# EasyEDA schematic SCH_Aquaguard-system_2026-05-28.json
TITLE: Aquaguard project; REV: 1.0; Date: 2025-04-28; Sheet: 1/1; Drawn By: Mostapha Droubi; Company: Your Company
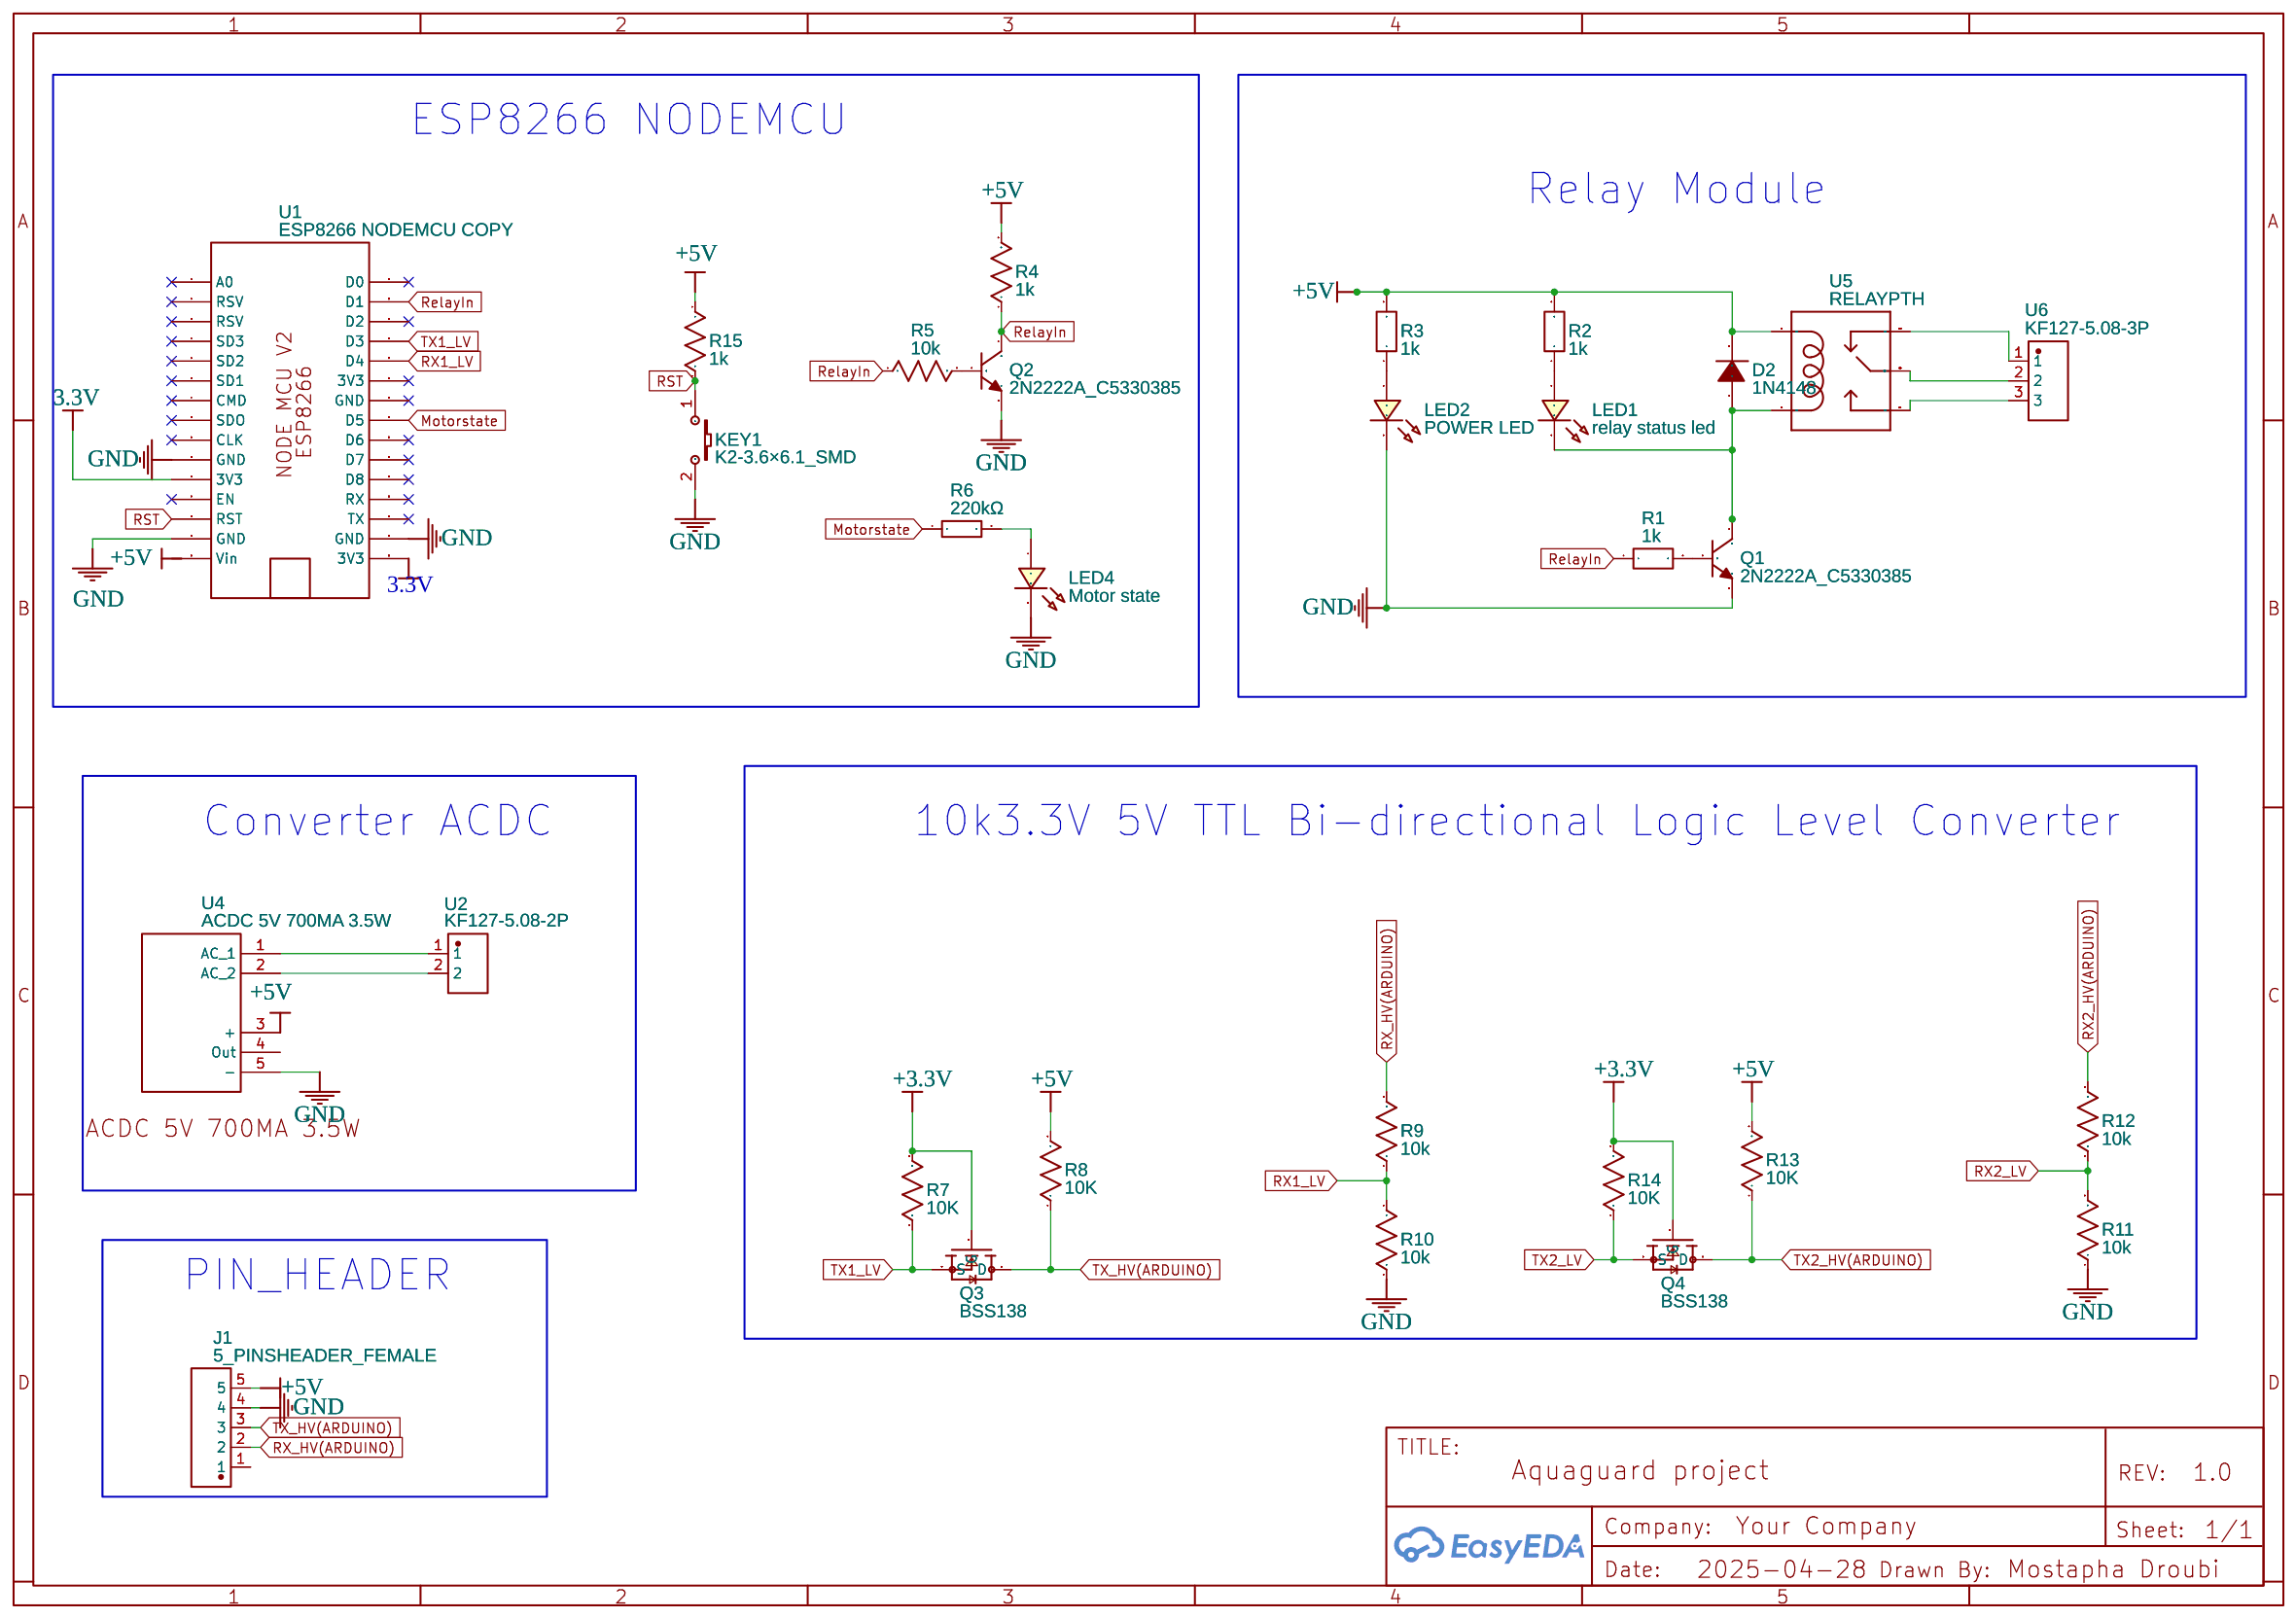
[diagram p0: schematic sheet]

## Parts
D2  1N4148  [DO-35_BD2.0-L4.0-P8.00-D0.5-FD]
J1  5_PINSHEADER_FEMALE  [6_PINSHEADER_FEMALE]
KEY1  K2-3.6×6.1_SMD  [KEY-SMD_2P-L6.2-W3.6-LS8.0]
LED1  relay status led  [LED-TH_BD3.0_GREEN]
LED2  POWER LED  [LED0603_RED]
LED4  Motor state  [LED0805_BLUE]
Q1  2N2222A_C5330385  [TO-92-3_L4.8-W3.7-P2.54-R]
Q2  2N2222A_C5330385  [TO-92-3_L4.8-W3.7-P2.54-R]
Q3  BSS138  [BSS138]
Q4  BSS138  [BSS138]
R1  1k  [R0201]
R2  1k  [R0201]
R3  1k  [R0201]
R4  1k  [R0603]
R5  10k  [R0603]
R6  220kΩ  [R0805]
R7  10K  [R0603]
R8  10K  [R0603]
R9  10k  [R0603]
R10  10k  [R0603]
R11  10k  [R0603]
R12  10k  [R0603]
R13  10K  [R0603]
R14  10K  [R0603]
R15  1k  [R0603]
U1  ESP8266 NODEMCU COPY  [ESP8266NODEMCU]
U2  KF127-5.08-2P  [CONN-TH_P5.08_KF127-5.08-2P]
U4  ACDC 5V 700MA 3.5W  [ACDC 5V 700MA 3.5W]
U5  RELAYPTH  [SRD-05VDC-SL-C]
U6  KF127-5.08-3P  [CONN-TH_3P-P5.08_KF127-5.08-3P]

## Library data of the parts
D2 = 1N4148: Supplier: LCSC; Manufacturer: ST(先科); Supplier Part: C14516; JLCPCB Part Class: Extended Part
J1 = 5_PINSHEADER_FEMALE: catid: 20; Contributor: kronto; sim: true
KEY1 = K2-3.6×6.1_SMD: Supplier Part: C118141; Supplier: LCSC; Manufacturer Part: K2-1107ST-A4SW-06; Contributor: LCEDA_Lib; 制造商: 韩国韩荣
LED1 = LED-TH-3mm_G: Manufacturer: EVERLIGHT(台湾亿光); Manufacturer Part: 204-10SYGD/S530-E3; Supplier Part: C85161; Contributor: LCEDA_Lib
LED2 = LED-0603_R: Manufacturer: EVERLIGHT(台湾亿光); Manufacturer Part: 19-217/R6C-AL1M2VY/3T; Supplier Part: C72044; Supplier: LCSC; Contributor: LCEDA_01
LED4 = LED-0805_B: Manufacturer: 方舟 ARKLED; Manufacturer Part: D-B080508B1-KS2; Supplier Part: C108412; Contributor: LCEDA_Lib
Q1 Q2 = 2N2222A_C5330385: Contributor: lcsc; Supplier: LCSC; Supplier Part: C5330385; Manufacturer: Slkor(萨科微); Manufacturer Part: 2N2222A; JLCPCB Part Class: Extended Part
Q3 Q4 = BSS138: Contributor: The_Doogy; Supplier: RS-Online; Supplier Part: 671-0324; Manufacturer: ON Semiconductor; link: https://www.onsemi.com/products/discretes-drivers/mosfets/bss138
R1-R3 = R_0201_EU: Contributor: LCEDA_Lib
R4 R5 R7-R15 = R_0603_US: Contributor: LCEDA_Lib
R6 = RC0805JR-07220KL: Contributor: LCSC; Supplier: LCSC; Manufacturer: YAGEO(国巨); Supplier Part: C114232; JLCPCB Part Class: Extended Part
U1 = ESP8266 NODEMCU COPY: Contributor: projakjo
U2 = KF127-5.08-2P: Contributor: LCSC; Supplier: LCSC; Supplier Part: C474906; Manufacturer: KEFA(科发); JLCPCB Part Class: Extended Part
U4 = ACDC 5V 700MA 3.5W: Contributor: valinotech
U5 = RELAYPTH: SPDT relay (COM-00101)
U6 = KF127-5.08-3P: Contributor: LCSC; Supplier: LCSC; Supplier Part: C474907; Manufacturer: KEFA(科发); JLCPCB Part Class: Extended Part

## Nets
3.3V: U1.11(3V3) U1.16(3V3)
+3.3V: Q3.G Q4.G R7.2 R14.2
+5V: D2.2(C) J1.5 R2.2 R3.2 R4.2 R8.2 R13.2 R15.1 U1.15(Vin) U4.3(+) U5.COIL1
GND: J1.4 KEY1.2 LED2.2 LED4.2 Q1.3(E) Q2.3(E) R10.1 R11.1 U1.10(GND) U1.14(GND) U1.17(GND) U4.5(-)
Motorstate: R6.1 U1.23(D5)
RelayIn: Q2.1(C) R1.1 R4.1 R5.1 U1.29(D1)
RST: KEY1.1 R15.2 U1.13(RST)
RX1_LV: R9.1 R10.2 U1.26(D4)
RX2_HV(ARDUINO): R12.2
RX2_LV: R11.2 R12.1
RX_HV(ARDUINO): J1.2 R9.2
TX1_LV: Q3.S R7.1 U1.27(D3)
TX2_HV(ARDUINO): Q4.D R13.1
TX2_LV: Q4.S R14.1
TX_HV(ARDUINO): J1.3 Q3.D R8.1
Net-(D2-1): D2.1(A) LED1.2 Q1.1(C) U5.COIL0
Net-(LED1-1): LED1.1 R2.1
Net-(LED2-1): LED2.1 R3.1
Net-(LED4-1): LED4.1 R6.2
Net-(Q1-2): Q1.2(B) R1.2
Net-(Q2-2): Q2.2(B) R5.2
Net-(U2-1): U2.1 U4.1(AC 1)
Net-(U2-2): U2.2 U4.2(AC 2)
Net-(U5-SWCLOSED): U5.SWCLOSED(SWCLOSE) U6.1
Net-(U5-SWCOMMON): U5.SWCOMMON U6.2
Net-(U5-SWOPEN): U5.SWOPEN U6.3

Not connected (* = marked no-connect by the designer): J1 1; U1 1(A0)* 2(RSV)* 3(RSV)* 4(SD3)* 5(SD2)* 6(SD1)* 7(CMD)* 8(SDO)* 9(CLK)* 12(EN)* 18(TX)* 19(RX)* 20(D8)* 21(D7)* 22(D6)* 24(GND)* 25(3V3)* 28(D2)* 30(D0)*; U4 4(Out)

## Notes on the sheet
- ESP8266 NODEMCU
- Relay Module
- Converter ACDC
- 10k3.3V 5V TTL Bi-directional Logic Level Converter
- PIN_HEADER
